# Altium schematic sheet JTAG.SchDoc: Dahlia Carrier Board
size A3; Organization: Toradex AG; Address1: Ebenaustrasse 10; Address2: Horw; Address3: 6048; Address4: Switzerland; DocumentNumber: 12; Revision: V1.1; SheetNumber: 12; SheetTotal: 21; PageSetup: Record=PageOptions|CenterHorizontal=True|CenterVertical=True|PrintScale=0.71|XCorrection=1.00|YCorrection=1.00|PrintKind=1|BorderSize=5000000|LeftOffset=0|BottomOffset=0|Orientation=2|PaperLength=1000|PaperWidth=1000|Scale=100|PaperSource=15|PrintQuality=600|MediaType=1|DitherType=10|PaperKind=A4|PrintScaleMode=1
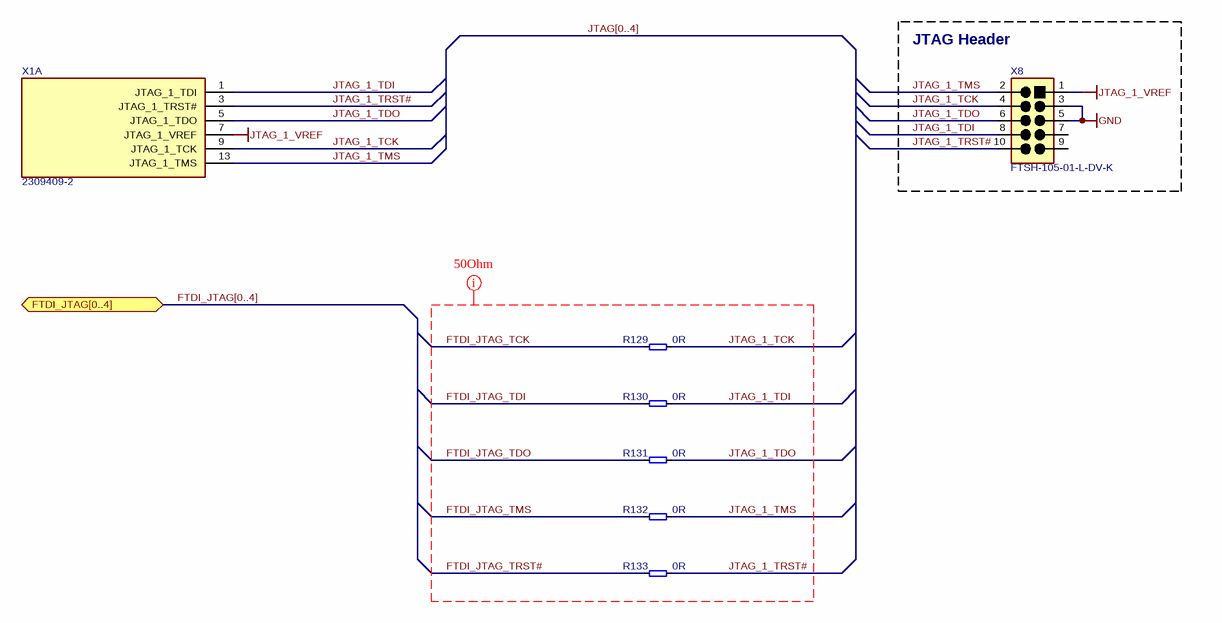
[diagram p0: JTAG.SchDoc]

## Parts
R129  0R  [T_RESC0603X30N]
R130  0R  [T_RESC0603X30N]
R131  0R  [T_RESC0603X30N]
R132  0R  [T_RESC0603X30N]
R133  0R  [T_RESC0603X30N]
X1  2309409-2  [CON-TE-2309409-2-SOLDERABLE-STANDOFFS]  (part A of 23)
X8  FTSH-105-01-L-DV-K  [T_Samtec_FTSH-105-01-L-DV]

## Blocks framed on the sheet
JTAG Header: X8

## Ports
FTDI_JTAG[0..4] (bidir)

## Nets
GND: X8.3 X8.5
JTAG_1_VREF: X1.7(JTAG_1_VREF) X8.1
FTDI_JTAG_TCK: R129.1
FTDI_JTAG_TDI: R130.1
FTDI_JTAG_TDO: R131.1
FTDI_JTAG_TMS: R132.1
FTDI_JTAG_TRST#: R133.1
JTAG_1_TCK: R129.2 X1.9(JTAG_1_TCK) X8.4
JTAG_1_TDI: R130.2 X1.1(JTAG_1_TDI) X8.8
JTAG_1_TDO: R131.2 X1.5(JTAG_1_TDO) X8.6
JTAG_1_TMS: R132.2 X1.13(JTAG_1_TMS) X8.2
JTAG_1_TRST#: R133.2 X1.3(JTAG_1_TRST#) X8.10

Not connected (* = marked no-connect by the designer): X8 7 9

## Buses and harness runs
bus FTDI_JTAG[0..4] = port FTDI_JTAG[0..4]
bus JTAG[0..4]

## Layout directives
net class 50Ohm: FTDI_JTAG_TCK, FTDI_JTAG_TDI, FTDI_JTAG_TDO, FTDI_JTAG_TMS, FTDI_JTAG_TRST#, JTAG_1_TCK, JTAG_1_TDI, JTAG_1_TDO, JTAG_1_TMS, JTAG_1_TRST#

## Notes on the sheet
- Title
- Size:
- Date:
- A3
- Number:
- Time:
- Revision:
- Sheet
- of
- File:

## Library data of the parts
R129-R133 = R-0R-63mW-1%-0603: Resistor 0 ohm 63mW 1% 0603; Rating: 63mW; Tolerance: 1%; Value: 0R
X1 = CON-TE-2309409-2: DDR4 SODIMM Socket, 260 pins, 5.2mm(H), 0.5mm Pitch; Manufacturer Name: TE; Temperature Range: -40C to +125C; Package: DDR4-SODIMM-260; Manufacturer Part No.: 2309409-2
X8 = CON-Samtec-FTSH-105-01-L-DV-1X10-1.27mm: Male Header, 10-Pin, 1.27mm Pitch; Manufacturer Name: Samtec; No. of ways: 1X10; Pitch: 1.27mm; Manufacturer Part No.: FTSH-105-01-L-DV-K